# Altium schematic sheet Debug.SchDoc: Debug
size B; DrawnBy: Jasper Yun; SheetNumber: 13; SheetTotal: 13; Competition: SAC 2021; Subteam: Avionics; University: McGill University; Location: Montreal, Quebec; Project: Avionics Project Name; MRT: McGill Rocket Team
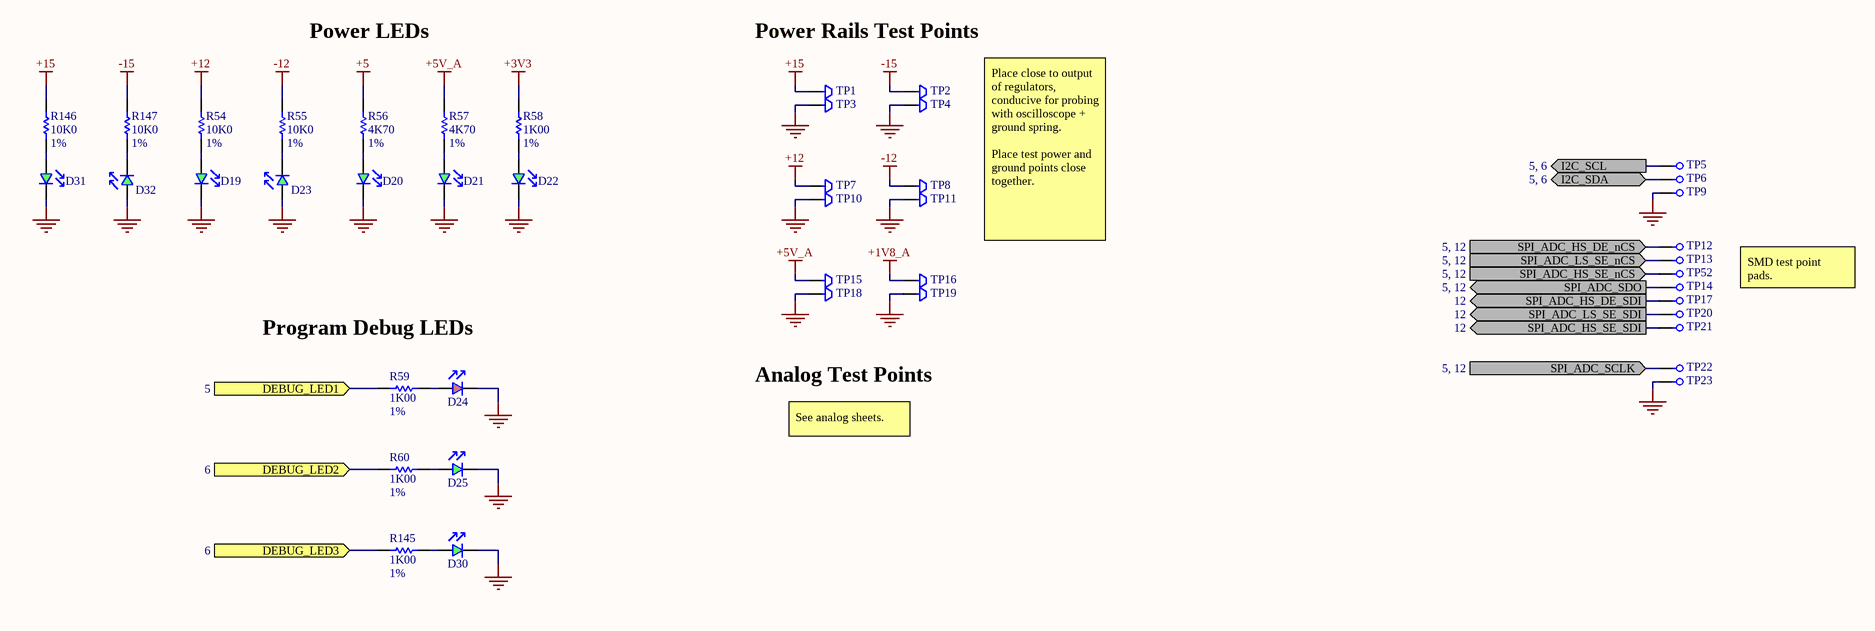
[diagram p0: Debug.SchDoc]

## Parts
D19  LED Green  [0603 LED]  (value not drawn)
D20  LED Green  [0603 LED]  (value not drawn)
D21  LED Green  [0603 LED]  (value not drawn)
D22  LED Green  [0603 LED]  (value not drawn)
D23  LED Green  [0603 LED]  (value not drawn)
D24  LED Red  [0603 LED]  (value not drawn)
D25  LED Green  [0603 LED]  (value not drawn)
D30  LED Green  [0603 LED]  (value not drawn)
D31  LED Green  [0603 LED]  (value not drawn)
D32  LED Green  [0603 LED]  (value not drawn)
R54  10K0  value 1%  [0402 RES]
R55  10K0  value 1%  [0402 RES]
R56  4K70  value 1%  [0402 RES]
R57  4K70  value 1%  [0402 RES]
R58  1K00  value 1%  [0402 RES]
R59  1K00  value 1%  [0402 RES]
R60  1K00  value 1%  [0402 RES]
R145  1K00  value 1%  [0402 RES]
R146  10K0  value 1%  [0402 RES]
R147  10K0  value 1%  [0402 RES]
TP1  Test Point - Keystone 5015  [Test Point Keystone 5015]  (value not drawn)
TP2  Test Point - Keystone 5015  [Test Point Keystone 5015]  (value not drawn)
TP3  Test Point - Keystone 5015  [Test Point Keystone 5015]  (value not drawn)
TP4  Test Point - Keystone 5015  [Test Point Keystone 5015]  (value not drawn)
TP5  Test Point - SMD Pad  [TEST POINT SMD PAD]  (value not drawn)  (no BOM)
TP6  Test Point - SMD Pad  [TEST POINT SMD PAD]  (value not drawn)  (no BOM)
TP7  Test Point - Keystone 5015  [Test Point Keystone 5015]  (value not drawn)
TP8  Test Point - Keystone 5015  [Test Point Keystone 5015]  (value not drawn)
TP9  Test Point - SMD Pad  [TEST POINT SMD PAD]  (value not drawn)  (no BOM)
TP10  Test Point - Keystone 5015  [Test Point Keystone 5015]  (value not drawn)
TP11  Test Point - Keystone 5015  [Test Point Keystone 5015]  (value not drawn)
TP12  Test Point - SMD Pad  [TEST POINT SMD PAD]  (value not drawn)  (no BOM)
TP13  Test Point - SMD Pad  [TEST POINT SMD PAD]  (value not drawn)  (no BOM)
TP14  Test Point - SMD Pad  [TEST POINT SMD PAD]  (value not drawn)  (no BOM)
TP15  Test Point - Keystone 5015  [Test Point Keystone 5015]  (value not drawn)
TP16  Test Point - Keystone 5015  [Test Point Keystone 5015]  (value not drawn)
TP17  Test Point - SMD Pad  [TEST POINT SMD PAD]  (value not drawn)  (no BOM)
TP18  Test Point - Keystone 5015  [Test Point Keystone 5015]  (value not drawn)
TP19  Test Point - Keystone 5015  [Test Point Keystone 5015]  (value not drawn)
TP20  Test Point - SMD Pad  [TEST POINT SMD PAD]  (value not drawn)  (no BOM)
TP21  Test Point - SMD Pad  [TEST POINT SMD PAD]  (value not drawn)  (no BOM)
TP22  Test Point - SMD Pad  [TEST POINT SMD PAD]  (value not drawn)  (no BOM)
TP23  Test Point - SMD Pad  [TEST POINT SMD PAD]  (value not drawn)  (no BOM)
TP52  Test Point - SMD Pad  [TEST POINT SMD PAD]  (value not drawn)  (no BOM)

## Ports
DEBUG_LED1 (in, see 5), DEBUG_LED2 (in, see 6), DEBUG_LED3 (in, see 6), I2C_SCL (out, see 5, 6), I2C_SDA (bidir, see 5, 6), SPI_ADC_HS_DE_nCS (in, see 5, 12), SPI_ADC_HS_DE_SDI (out, see 12), SPI_ADC_HS_SE_nCS (in, see 5, 12), SPI_ADC_HS_SE_SDI (out, see 12), SPI_ADC_LS_SE_nCS (in, see 5, 12), SPI_ADC_LS_SE_SDI (out, see 12), SPI_ADC_SCLK (in, see 5, 12), SPI_ADC_SDO (out, see 5, 12)

## Nets
+1V8_A: TP16.1
+3V3: R58.2
+5: R56.2
+5V_A: R57.2 TP15.1
+12: R54.2 TP7.1
+15: R146.2 TP1.1
-12: R55.2 TP8.1
-15: R147.2 TP2.1
GND: D19.2(Cathode) D20.2(Cathode) D21.2(Cathode) D22.2(Cathode) D23.1(Anode) D24.2(Cathode) D25.2(Cathode) D30.2(Cathode) D31.2(Cathode) D32.1(Anode) TP3.1 TP4.1 TP9.1 TP10.1 TP11.1 TP18.1 TP19.1 TP23.1
DEBUG_LED1: R59.2 ; port DEBUG_LED1
DEBUG_LED2: R60.2 ; port DEBUG_LED2
DEBUG_LED3: R145.2 ; port DEBUG_LED3
I2C_SCL: TP5.1 ; port I2C_SCL
I2C_SDA: TP6.1 ; port I2C_SDA
SPI_ADC_HS_DE_nCS: TP12.1 ; port SPI_ADC_HS_DE_nCS
SPI_ADC_HS_DE_SDI: TP17.1 ; port SPI_ADC_HS_DE_SDI
SPI_ADC_HS_SE_nCS: TP52.1 ; port SPI_ADC_HS_SE_nCS
SPI_ADC_HS_SE_SDI: TP21.1 ; port SPI_ADC_HS_SE_SDI
SPI_ADC_LS_SE_nCS: TP13.1 ; port SPI_ADC_LS_SE_nCS
SPI_ADC_LS_SE_SDI: TP20.1 ; port SPI_ADC_LS_SE_SDI
SPI_ADC_SCLK: TP22.1 ; port SPI_ADC_SCLK
SPI_ADC_SDO: TP14.1 ; port SPI_ADC_SDO
NetD19_1: D19.1(Anode) R54.1
NetD20_1: D20.1(Anode) R56.1
NetD21_1: D21.1(Anode) R57.1
NetD22_1: D22.1(Anode) R58.1
NetD23_2: D23.2(Cathode) R55.1
NetD24_1: D24.1(Anode) R59.1
NetD25_1: D25.1(Anode) R60.1
NetD30_1: D30.1(Anode) R145.1
NetD31_1: D31.1(Anode) R146.1
NetD32_2: D32.2(Cathode) R147.1

## Notes on the sheet
- Power LEDs
- Power Rails Test Points
- Place close to output of regulators, conducive for probing with oscilloscope + ground spring.
  Place test power and ground points close together.
- SMD test point pads.
- Program Debug LEDs
- Analog Test Points
- See analog sheets.
- Title
- Size:
- Date:
- B
- Revision:
- Time:
- Drawn By:
- Sheet
- of
- File:

## Library data of the parts
D19-D23 D25 D30-D32 = LED Green: Generic Green LED
D24 = LED Red: Generic Red LED
R54-R60 R145-R147 = Res1: Resistor; Published: 8-Jun-2000; LatestRevisionDate: 17-Jul-2002; LatestRevisionNote: Re-released for DXP Platform.; PackageReference: AXIAL-0.3; Publisher: Altium Limited; PackageDescription: Axial Device, Thru-Hole; 2 Leads; 0.3 in Pin Spacing
TP1-TP4 TP7 TP8 TP10 TP11 TP15 TP16 TP18 TP19 = Test Point - Keystone 5015: Keystone 5015 Test point
TP5 TP6 TP9 TP12-TP14 TP17 TP20-TP23 TP52 = Test Point - SMD Pad: SMD Pad test point